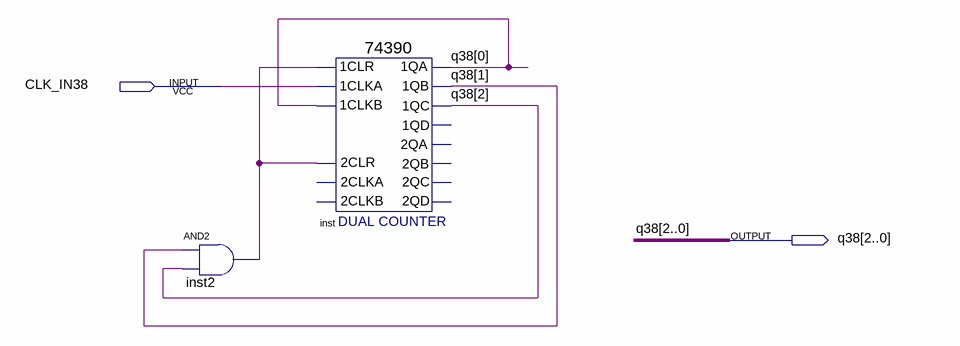
[diagram p0: schematic sheet]
// Quartus schematic cnt10_38.bdf as structural Verilog: 2 symbols, 2 pins
module cnt10_38 (
  input  CLK_IN38,
  output [2:0] q38
);

  wire inst2_out;

  and inst2 (inst2_out, q38[1], q38[2]);
  \74390  inst (
    .\2CLR (inst2_out), .\1CLR (inst2_out), .\1CLKA (CLK_IN38), .\1CLKB (q38[0]), .\1QA (q38[0]),
    .\1QB (q38[1]), .\1QC (q38[2]));  // open: 2CLKA, 2CLKB, 1QD, 2QA, 2QB, 2QC, 2QD
endmodule
